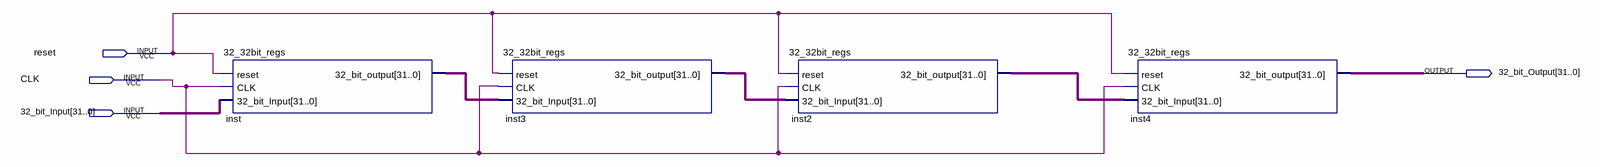
[diagram p0: schematic sheet]
// Quartus schematic 128_32bit_regs.bdf as structural Verilog: 4 symbols, 4 pins
module \128_32bit_regs  (
  input  reset,
  input  CLK,
  input  [31:0] \32_bit_Input ,
  output [31:0] \32_bit_Output 
);

  wire [31:0] inst2_32_bit_output, inst3_32_bit_output, inst_32_bit_output;

  \32_32bit_regs  inst (
    .reset(reset), .CLK(CLK), .\32_bit_Input (\32_bit_Input ), .\32_bit_output (inst_32_bit_output));
  \32_32bit_regs  inst3 (
    .reset(reset), .CLK(CLK), .\32_bit_Input (inst_32_bit_output), .\32_bit_output (inst3_32_bit_output));
  \32_32bit_regs  inst2 (
    .reset(reset), .CLK(CLK), .\32_bit_Input (inst3_32_bit_output), .\32_bit_output (inst2_32_bit_output));
  \32_32bit_regs  inst4 (
    .reset(reset), .CLK(CLK), .\32_bit_Input (inst2_32_bit_output), .\32_bit_output (\32_bit_Output ));
endmodule
